# Altium schematic sheet XRACER-SD-USB-R07.SchDoc
size A4
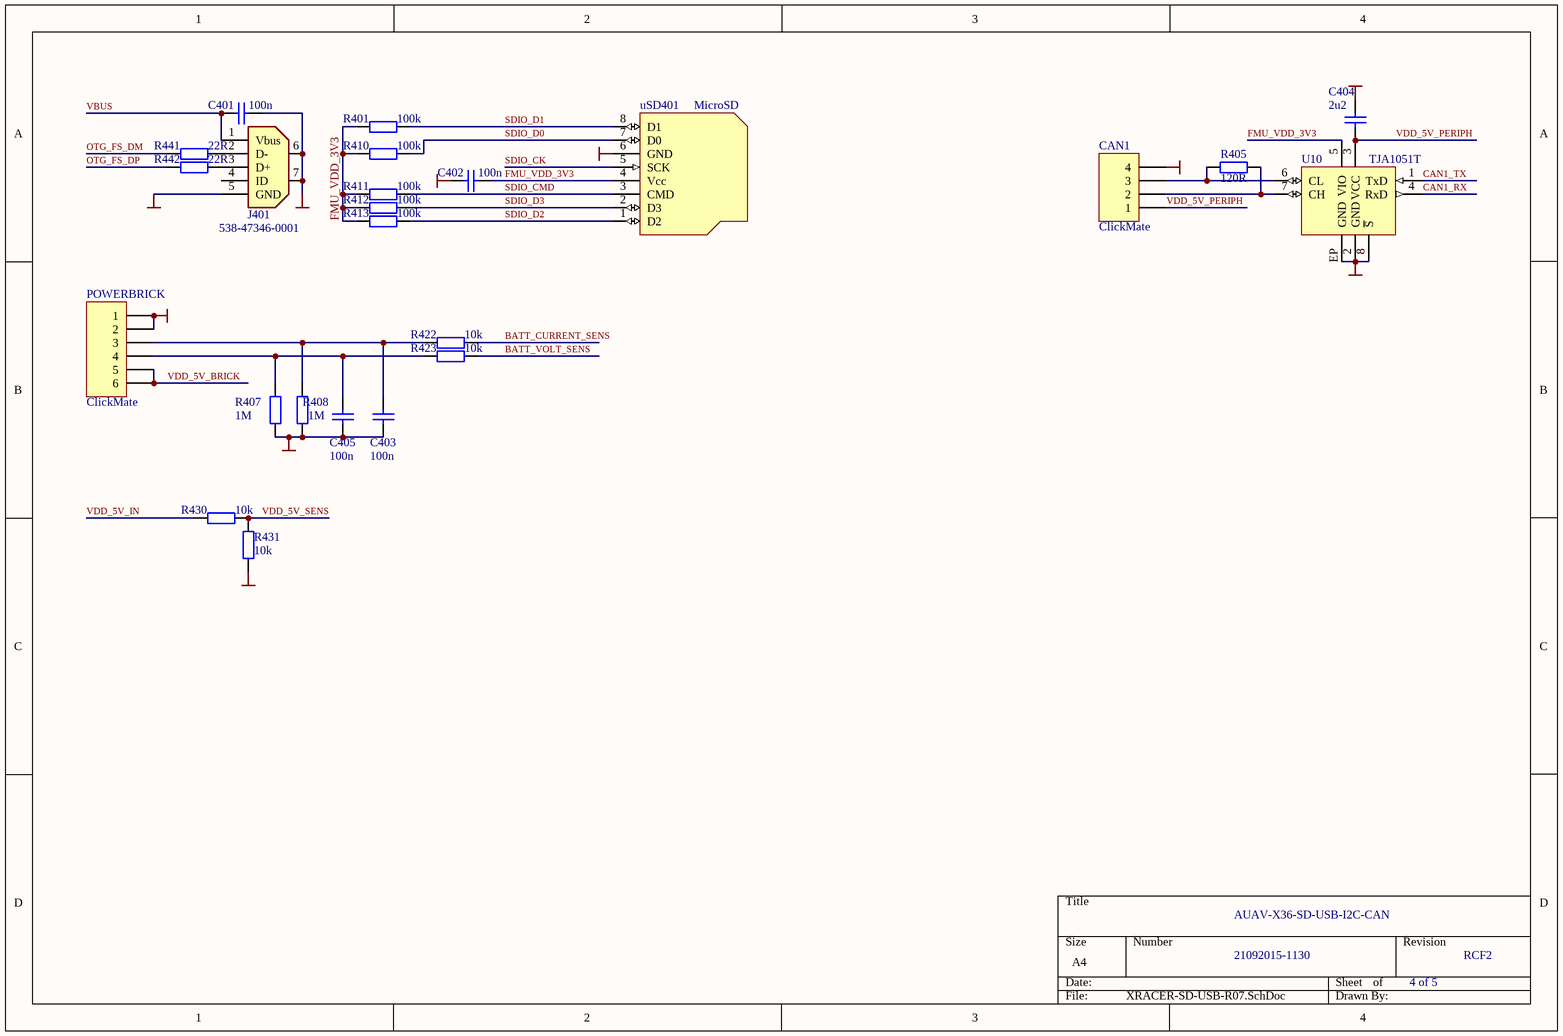
[diagram p0: XRACER-SD-USB-R07.SchDoc]

## Parts
C401  100n  [0402A]
C402  100n  [0402A]
C403  100n  [0402A]
C404  2u2  [0603A]
C405  100n  [0402A]
CAN1  ClickMate  [Molex_1.25_click_4]
J401  Mouser Part Number: 538-47346-0001  [USBmicro_B]  (hidden comment: miniUSB)
POWERBRICK  ClickMate  [Molex_Clok_1.25_6H]
R401  100k  [0402A]
R405  120R  [0603A]
R407  1M  [0402A]
R408  1M  [0402A]
R410  100k  [0402A]
R411  100k  [0402A]
R412  100k  [0402A]
R413  100k  [0402A]
R422  10k  [0402A]
R423  10k  [0402A]
R430  10k  [0402A]
R431  10k  [0402A]
R441  22R  [0402A]
R442  22R  [0402A]
U10  TJA1051T  [8DFN_3x3]
uSD401  MicroSD  [MicroSD_China_01]

## Nets
GND: C401.1 C402.2 C403.2 C404.1 C405.2 CAN1.4 J401.5(GND) J401.6(GND) J401.7(GND) POWERBRICK.1 POWERBRICK.2 R407.2 R408.2 R431.2 U10.2(GND) U10.8(~{S}) U10.EP(GND) uSD401.6(GND)
BATT_CURRENT_SENS: R422.1
BATT_VOLT_SENS: R423.1
CAN1_RX: U10.4(RxD)
CAN1_TX: U10.1(TxD)
FMU_VDD_3V3: C402.1 R401.2 R410.2 R411.2 R412.2 R413.2 U10.5(VIO) uSD401.4(Vcc)
OTG_FS_DM: R441.2
OTG_FS_DP: R442.2
SDIO_CK: uSD401.5(SCK)
SDIO_CMD: R411.1 uSD401.3(CMD)
SDIO_D0: R410.1 uSD401.7(D0)
SDIO_D1: R401.1 uSD401.8(D1)
SDIO_D2: R413.1 uSD401.1(D2)
SDIO_D3: R412.1 uSD401.2(D3)
VBUS: C401.2 J401.1(Vbus)
VDD_5V_BRICK: POWERBRICK.5 POWERBRICK.6
VDD_5V_IN: R430.2
VDD_5V_PERIPH: C404.2 CAN1.1 U10.3(VCC)
VDD_5V_SENS: R430.1 R431.1
NetC403_1: C403.1 POWERBRICK.3 R408.1 R422.2
NetC405_1: C405.1 POWERBRICK.4 R407.1 R423.2
NetCAN1_2: CAN1.2 R405.1 U10.7(CH)
NetCAN1_3: CAN1.3 R405.2 U10.6(CL)
NetJ401_2: J401.2(D-) R441.1
NetJ401_3: J401.3(D+) R442.1

Not connected (* = marked no-connect by the designer): J401 4(ID)

## Notes on the sheet
- AUAV-X36-SD-USB-I2C-CAN
- 21092015-1130
- 4 of 5
- RCF2

## Library data of the parts
C401-C405 = Cap: Capacitor; Value: 100pF; Published: 8-Jun-2000; LatestRevisionDate: 17-Jul-2002; LatestRevisionNote: Re-released for DXP Platform.; PackageReference: RAD-0.3; Publisher: Altium Limited
CAN1 = Header 4: Header, 4-Pin; LatestRevisionDate: 17-Jul-2002; LatestRevisionNote: Re-released for DXP Platform.; Publisher: Altium Limited
J401 = MicroUSB
POWERBRICK = Header 6: Header, 6-Pin; LatestRevisionDate: 17-Jul-2002; LatestRevisionNote: Re-released for DXP Platform.; Publisher: Altium Limited
R401 R405 R407 R408 R410-R413 R422 R423 R430 R431 R441 R442 = Res2: Resistor; Value: 1K; Published: 8-Jun-2000; LatestRevisionDate: 17-Jul-2002; LatestRevisionNote: Re-released for DXP Platform.; PackageReference: AXIAL-0.4; Publisher: Altium Limited
  R401 R407 R408 R410-R413 R422 R423 R430 R431 R441 R442: PackageDescription: Axial Device, Thru-Hole; 2 Leads; 0.4 in Pin Spacing